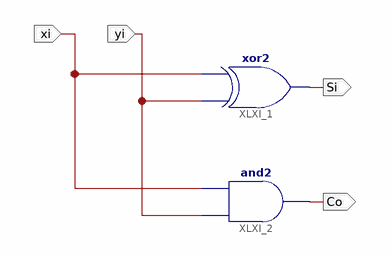
[diagram p0: schematic sheet 1]
// Xilinx ISE schematic sumador_medio_1b.sch (spartan6) as structural Verilog: 2 symbols, 4 ports
module sumador_medio_1b (
  input  xi,
  input  yi,
  output Si,
  output Co
);

  xor XLXI_1 (Si, yi, xi);
  and XLXI_2 (Co, yi, xi);
endmodule
